# EasyEDA schematic SCH_SQRT_2022-07-01.json
TITLE: Sheet_1; REV: 1.0; Date: 2022-05-14; Sheet: 1/1; Drawn By: parisot.eric.mail; Company: Your Company
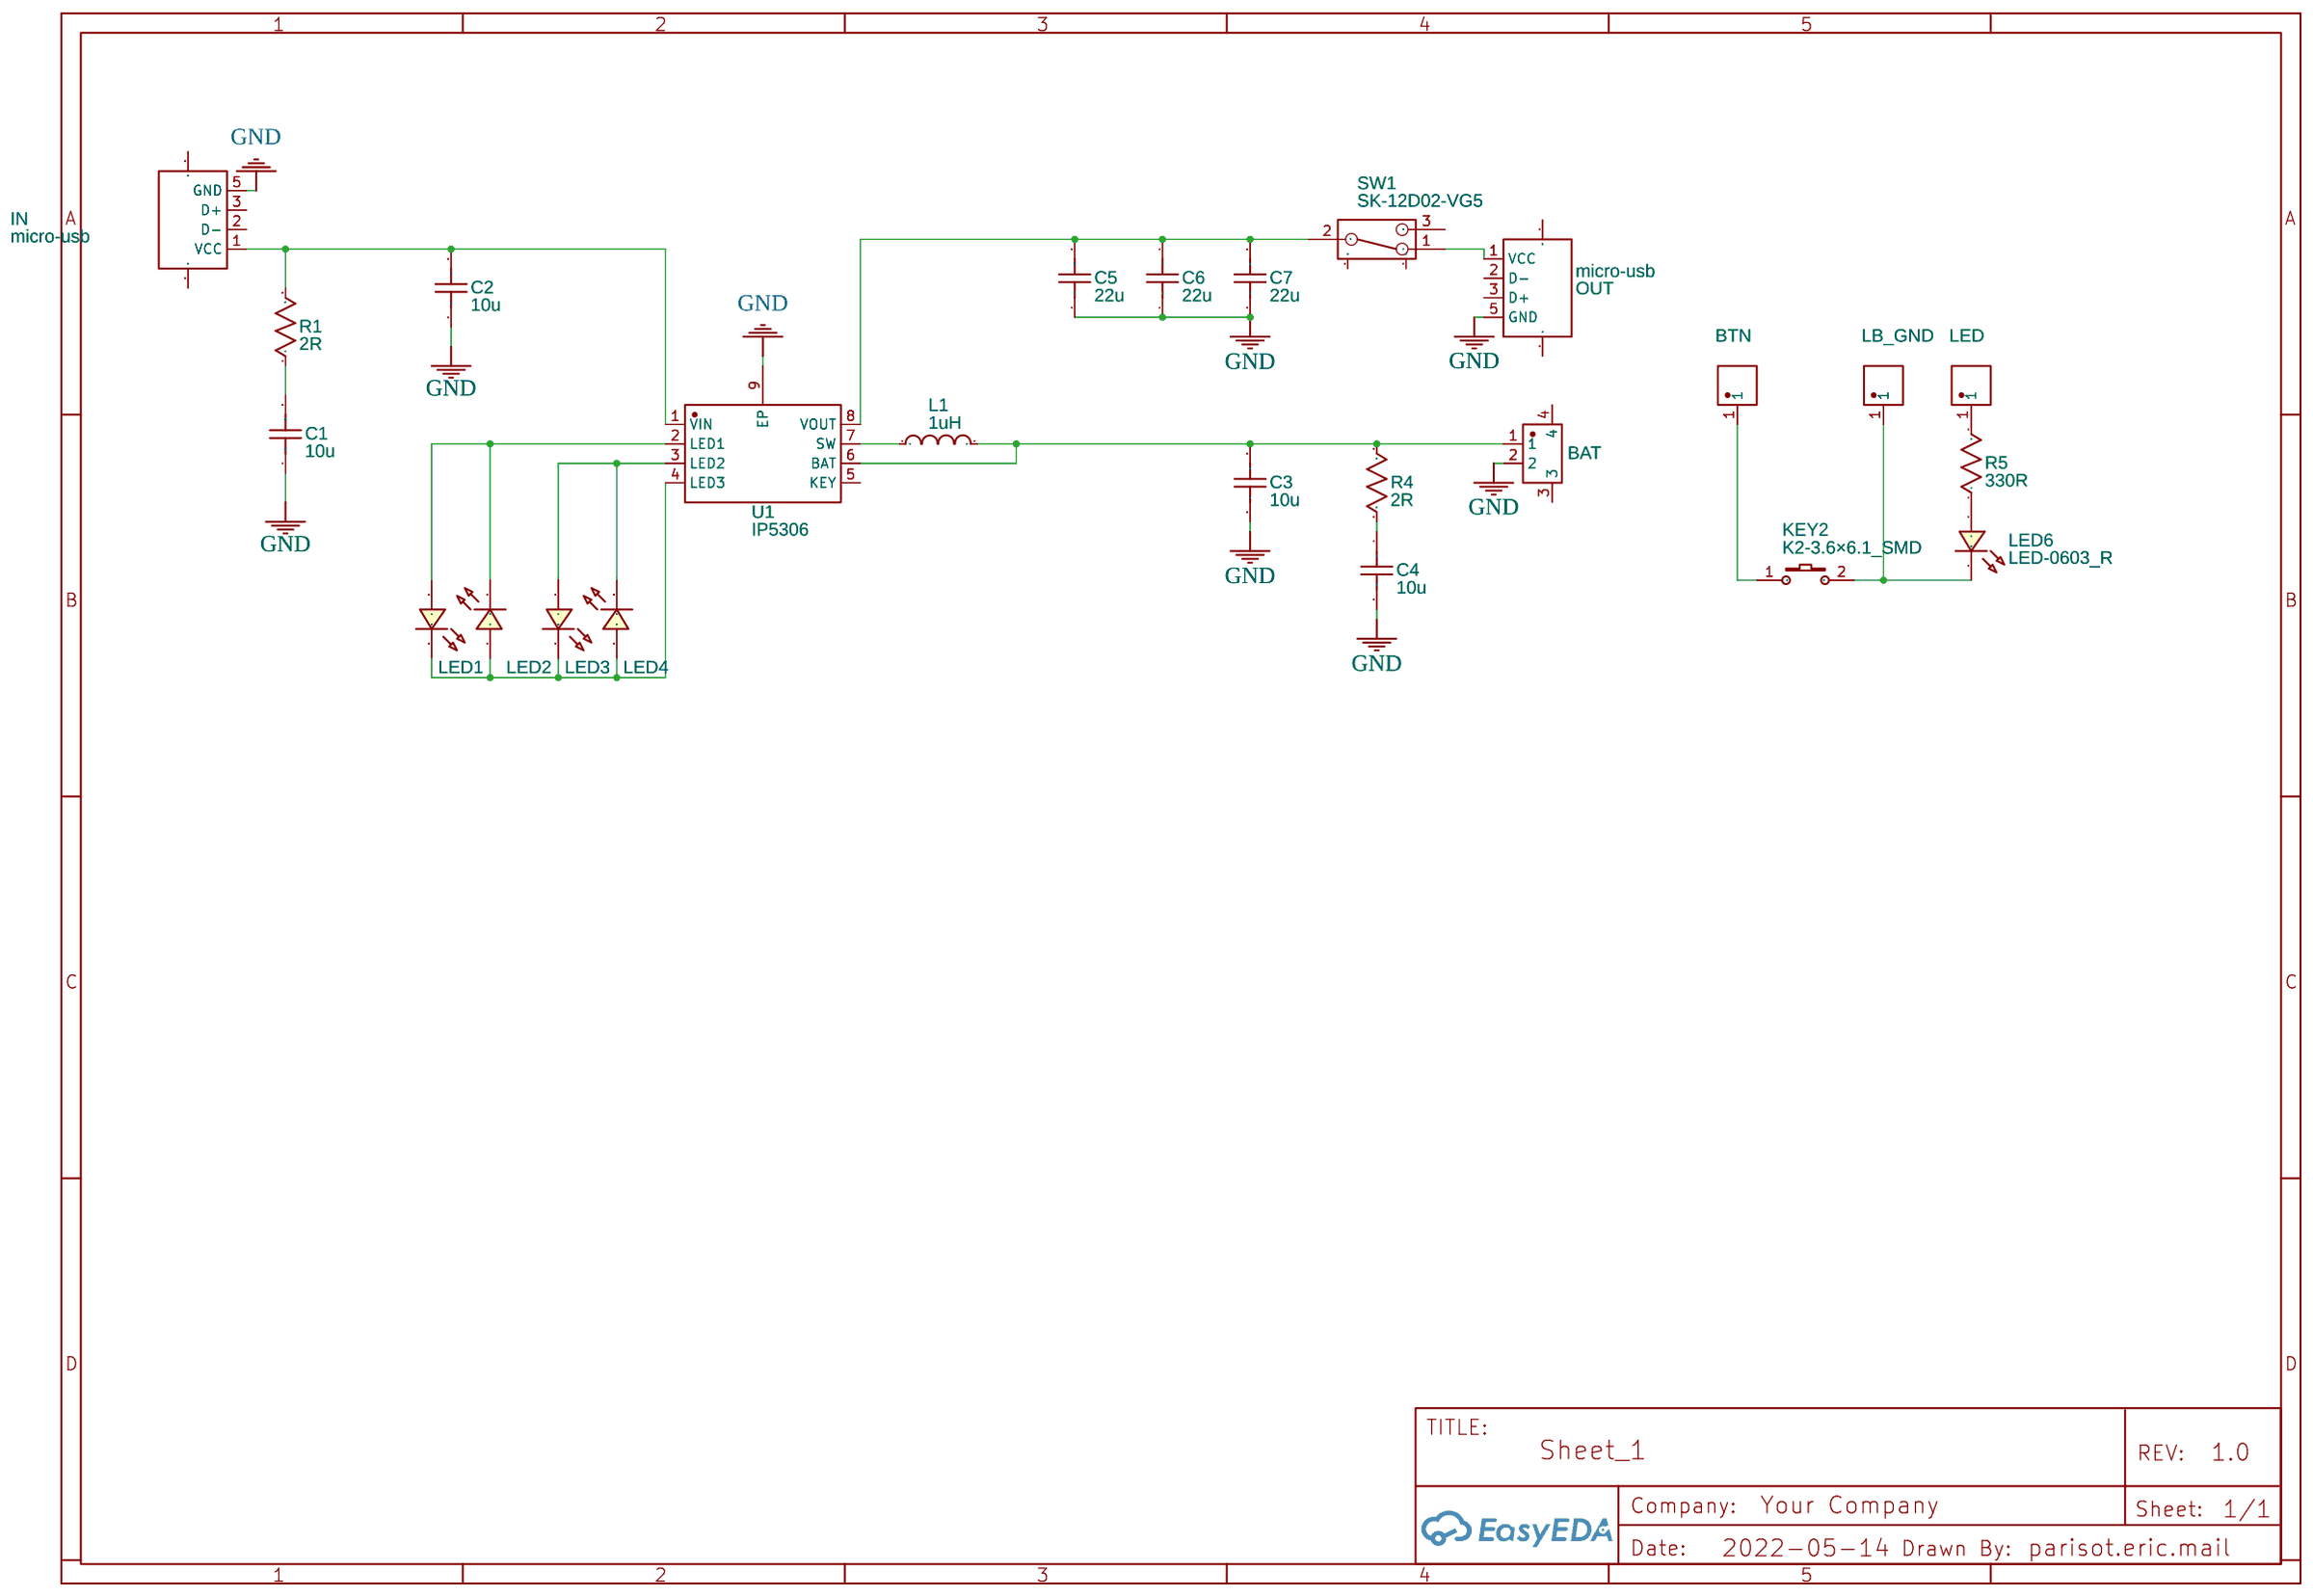
[diagram p0: schematic sheet]

## Parts
BAT  PH2.0-2PWB  [CONN-SMD_2P-P2.00_PH2.0-SPWB]
BTN  BAT  [1X01_POGOPIN_HOLE_0.58]
C1  10u  [C0603]
C2  10u  [C0603]
C3  10u  [C0603]
C4  10u  [C0603]
C5  22u  [C0603]
C6  22u  [C0603]
C7  22u  [C0603]
IN  micro-usb  [MICRO-USB-SMD10118194-0001LF]
KEY2  K2-3.6×6.1_SMD  [SW-TH_TC-1102N-C-C-B]
L1  1uH  [IND-SMD_L4.0-W3.0-LS4.3_1UH]
LB_GND  BAT  [1X01_POGOPIN_HOLE_0.58]
LED  BAT  [1X01_POGOPIN_HOLE_0.58]
LED1  LED-0603_R  [LED0603_RED]
LED2  LED-0603_R  [LED0603_RED]
LED3  LED-0603_R  [LED0603_RED]
LED4  LED-0603_R  [LED0603_RED]
LED6  LED-0603_R  [LED-TH_LED-3MM_RED]
OUT  micro-usb  [MICRO-USB-SMD10118194-0001LF]
R1  2R  [R0603]
R4  2R  [R0603]
R5  330R  [R0603]
SW1  SK-12D02-VG5  [SW-TH_SK-12D02-G050]
U1  IP5306  [ESOP-8_L4.9-W3.9-P1.27-LS6.0-BL-EP]

## Library data of the parts
BAT = PH2.0-2PWB: Supplier: LCSC; Manufacturer: BOOMELE; Manufacturer Part: PH2.0-2PWB Horizontal; Supplier Part: C47647; JLCPCB Part Class: Extended Part
BTN LB_GND LED = POGOPIN 弹簧顶针(9.0H-2.0T直通加粗): Supplier: LCSC; Supplier Part: C9900001338; Manufacturer: null; Manufacturer Part: pogopin 弹簧顶针(9.0H-2.0T直通加粗); JLCPCB Part Class: Extended Part; Contributor: LCSC
C1-C7 = C_0603_US: Contributor: LCEDA_Lib
IN OUT = USB-Type A_Male: Supplier Part: C112454; Supplier: LCSC; Manufacturer: SOFNG; Manufacturer Part: USB-05; Contributor: LCEDA_Lib
KEY2 = K2-3.6×6.1_SMD: Supplier Part: C118141; Supplier: LCSC; Manufacturer Part: K2-1107ST-A4SW-06; Contributor: LCEDA_Lib; 制造商: 韩国韩荣
L1 = L0603_US: Contributor: LCEDA_Lib
LED1-LED4 LED6 = LED-0603_R: Manufacturer: EVERLIGHT(台湾亿光); Manufacturer Part: 19-217/R6C-AL1M2VY/3T; Supplier Part: C72044; Supplier: LCSC; Contributor: LCEDA_01
R1 R4 R5 = R_0603_US: Contributor: LCEDA_Lib
SW1 = SK-12D02-VG5: Supplier: LCSC; Supplier Part: C480340; Manufacturer: Rectangular Connectors - Contacts; Contributor: LCSC; Package Display: No
U1 = IP5306: Supplier: LCSC; Supplier Part: C181692; Manufacturer: INJOINIC; Contributor: LCSC; JLCPCB Part Class: Extended Part

## Nets
GND: BAT.2 C1.1 C2.1 C3.1 C4.2 C5.1 C6.1 C7.1 IN.5(GND) OUT.5(GND) U1.9(EP)
Net-(BAT-1): BAT.1 C3.2 L1.2 R4.2 U1.6(BAT)
Net-(BTN-1): BTN.1 KEY2.1
Net-(C1-2): C1.2 R1.1
Net-(C2-2): C2.2 IN.1(VCC) R1.2 U1.1(VIN)
Net-(C4-1): C4.1 R4.1
Net-(C5-2): C5.2 C6.2 C7.2 SW1.2 U1.8(VOUT)
Net-(KEY2-2): KEY2.2 LB_GND.1 LED6.2
Net-(L1-1): L1.1 U1.7(SW)
Net-(LED1-1): LED1.1 LED2.2 U1.2(LED1)
Net-(LED1-2): LED1.2 LED2.1 LED3.2 LED4.1 U1.4(LED3)
Net-(LED3-1): LED3.1 LED4.2 U1.3(LED2)
Net-(LED6-1): LED6.1 R5.1
Net-(LED-1): LED.1 R5.2
Net-(OUT-1): OUT.1(VCC) SW1.1

Not connected (* = marked no-connect by the designer): BAT 3 4; IN 2(D-) 3(D+) 6(5); OUT 2(D-) 3(D+) 6(5); SW1 3 4 5; U1 5(KEY)
